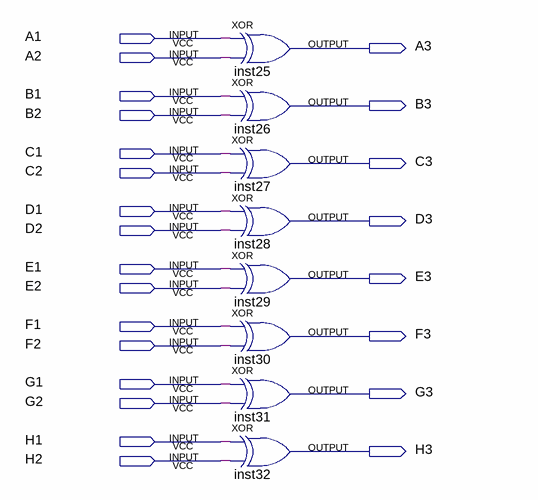
[diagram p0: schematic sheet]
// Quartus schematic OctaXOR.bdf as structural Verilog: 8 symbols, 24 pins
module OctaXOR (
  input  A1,
  input  A2,
  input  B1,
  input  B2,
  input  C1,
  input  C2,
  input  D1,
  input  D2,
  input  E1,
  input  E2,
  input  F1,
  input  F2,
  input  G1,
  input  G2,
  input  H1,
  input  H2,
  output A3,
  output B3,
  output C3,
  output D3,
  output E3,
  output F3,
  output G3,
  output H3
);

  xor inst25 (A3, A1, A2);
  xor inst26 (B3, B1, B2);
  xor inst27 (C3, C1, C2);
  xor inst28 (D3, D1, D2);
  xor inst29 (E3, E1, E2);
  xor inst30 (F3, F1, F2);
  xor inst31 (G3, G1, G2);
  xor inst32 (H3, H1, H2);
endmodule
